# EasyEDA schematic P07_SHARED_SENSORS.json
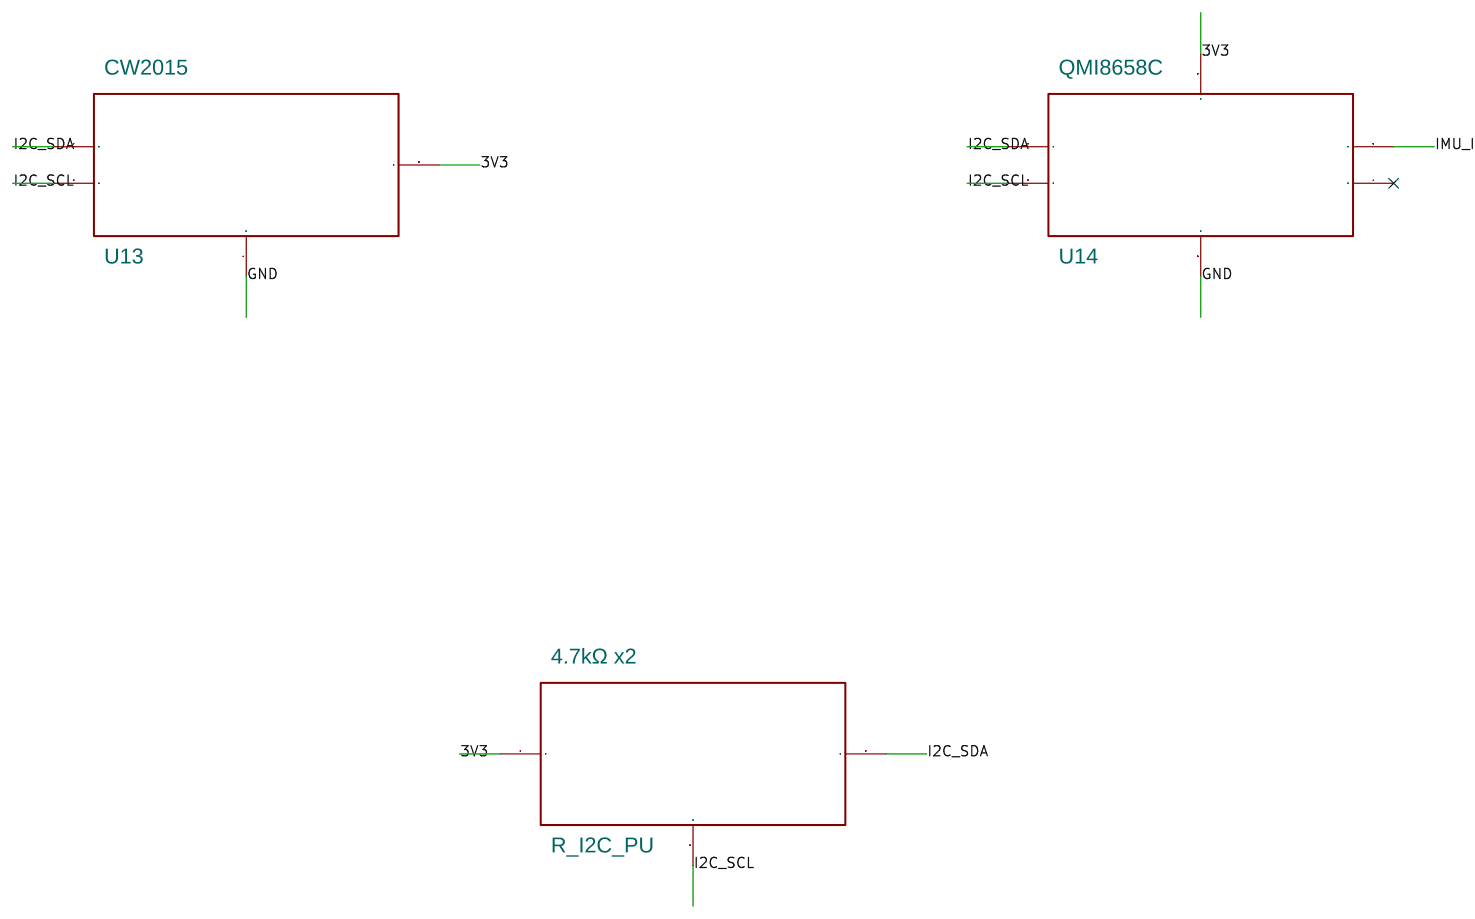
[diagram p0: schematic sheet]

## Parts
R_I2C_PU  4.7kΩ x2  [0603_ARRAY]
U13  CW2015  [DFN-8]
U14  QMI8658C  [LGA-16]

## Library data of the parts
R_I2C_PU = Pullup
U13 = Fuel_Gauge
U14 = QMI8658C

## Nets
3V3: R_I2C_PU.1 U13.3(1) U14.5(1)
GND: U13.4(1) U14.6(1)
I2C_SCL: R_I2C_PU.3(1) U13.2(1) U14.2(1)
I2C_SDA: R_I2C_PU.2(1) U13.1 U14.1
IMU_INT1: U14.3(1)

Not connected (* = marked no-connect by the designer): U14 4(1)*

## Notes on the sheet
- P07  共享 I²C：CW2015、QMI8658C 与总线测试点
- I2C0：SDA=IO1，SCL=IO2；统一上拉、单一仲裁，推荐初始 100kHz。
- QMI8658C 首版贴装但业务默认不启用，仅保留 INT1→IO41。
- 共享 7-bit 地址：BQ25895 0x6A、QMI8658C 0x6B（SA0 高）、CW2015 0x62、CST9217 0x5A、ES8311 0x18。
- QMI INT2 不接、不占 IO45；上电扫描若地址不符，先改基线/清单再改固件。
